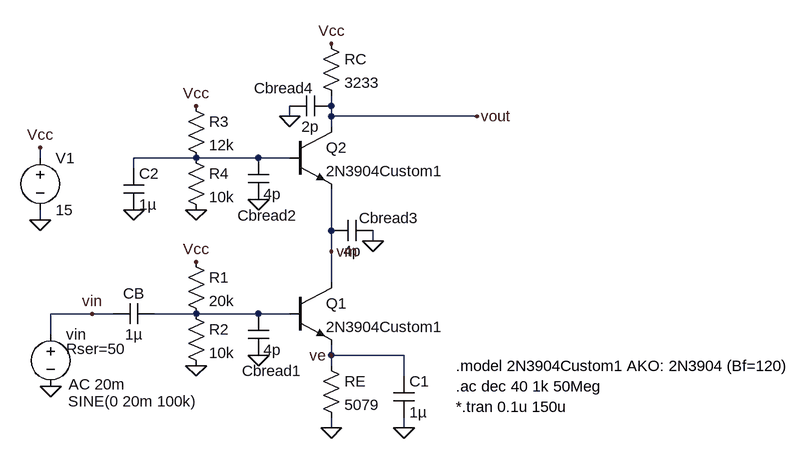
[diagram p0: schematic cascode.asc]
cascode.asc, the LTspice schematic file:
Version 4
SHEET 1 1252 680
WIRE 528 -96 528 -112
WIRE 464 -80 464 -96
WIRE 528 -80 528 -96
WIRE 752 -80 528 -80
WIRE 528 -64 528 -80
WIRE 80 -16 80 -32
WIRE 320 -16 224 -16
WIRE 416 -16 320 -16
WIRE 464 -16 416 -16
WIRE 224 0 224 -16
WIRE 80 80 80 64
WIRE 528 96 528 32
WIRE 592 112 592 96
WIRE 528 128 528 96
WIRE 528 176 528 128
WIRE 160 224 96 224
WIRE 192 224 160 224
WIRE 320 224 256 224
WIRE 416 224 320 224
WIRE 464 224 416 224
WIRE 96 256 96 224
WIRE 528 288 528 272
WIRE 640 288 528 288
WIRE 528 304 528 288
WIRE 640 320 640 288
WIRE 528 400 528 384
WIRE 640 400 640 384
FLAG 160 224 vin
FLAG 528 -192 Vcc
FLAG 752 -80 vout
FLAG 528 400 0
FLAG 80 80 0
FLAG 80 -32 Vcc
FLAG 528 288 ve
FLAG 96 336 0
FLAG 320 304 0
FLAG 320 144 Vcc
FLAG 320 64 0
FLAG 320 -96 Vcc
FLAG 224 64 0
FLAG 528 128 vm
FLAG 640 400 0
FLAG 416 288 0
FLAG 416 48 0
FLAG 592 112 0
FLAG 464 -80 0
SYMBOL Cap 256 208 R90
WINDOW 0 0 32 VBottom 2
WINDOW 3 32 32 VTop 2
SYMATTR InstName CB
SYMATTR Value 1µ
SYMBOL Res 512 -208 R0
SYMATTR InstName RC
SYMATTR Value 3233
SYMBOL Res 512 288 R0
SYMATTR InstName RE
SYMATTR Value 5079
SYMBOL Voltage 80 -32 R0
SYMATTR InstName V1
SYMATTR Value 15
SYMBOL npn 464 176 R0
SYMATTR InstName Q1
SYMATTR Value 2N3904Custom1
SYMBOL Cap 624 320 R0
SYMATTR InstName C1
SYMATTR Value 1µ
SYMBOL Voltage 96 240 R0
WINDOW 123 28 93 Left 2
WINDOW 3 27 119 Left 2
WINDOW 39 24 38 Left 2
SYMATTR Value2 AC 20m
SYMATTR Value SINE(0 20m 100k)
SYMATTR SpiceLine Rser=50
SYMATTR InstName vin
SYMBOL Res 304 128 R0
SYMATTR InstName R1
SYMATTR Value 20k
SYMBOL Res 304 208 R0
SYMATTR InstName R2
SYMATTR Value 10k
SYMBOL npn 464 -64 R0
SYMATTR InstName Q2
SYMATTR Value 2N3904Custom1
SYMBOL Res 304 -112 R0
SYMATTR InstName R3
SYMATTR Value 12k
SYMBOL Res 304 -32 R0
SYMATTR InstName R4
SYMATTR Value 10k
SYMBOL Cap 208 0 R0
SYMATTR InstName C2
SYMATTR Value 1µ
SYMBOL Cap 400 224 R0
WINDOW 0 -9 88 Left 2
SYMATTR InstName Cbread1
SYMATTR Value 4p
SYMBOL Cap 400 -16 R0
WINDOW 0 -16 89 Left 2
SYMATTR InstName Cbread2
SYMATTR Value 4p
SYMBOL Cap 592 80 R90
WINDOW 0 12 -25 VBottom 2
WINDOW 3 32 32 VTop 2
SYMATTR InstName Cbread3
SYMATTR Value 4p
SYMBOL Cap 528 -112 R90
WINDOW 0 4 72 VBottom 2
WINDOW 3 32 32 VTop 2
SYMATTR InstName Cbread4
SYMATTR Value 2p
TEXT 720 304 Left 2 !.model 2N3904Custom1 AKO: 2N3904 (Bf=120)
TEXT 720 336 Left 2 !.ac dec 40 1k 50Meg\n*.tran 0.1u 150u

The netlist it stands for:
* cascode.asc
CB N002 vin 1µ
RC Vcc vout 3233
RE ve 0 5079
V1 Vcc 0 15
Q1 vm N002 ve 0 2N3904Custom1
C1 ve 0 1µ
vin vin 0 SINE(0 20m 100k) AC 20m Rser=50
R1 Vcc N002 20k
R2 N002 0 10k
Q2 vout N001 vm 0 2N3904Custom1
R3 Vcc N001 12k
R4 N001 0 10k
C2 N001 0 1µ
Cbread1 N002 0 4p
Cbread2 N001 0 4p
Cbread3 0 vm 4p
Cbread4 vout 0 2p
.model NPN NPN
.model PNP PNP
.lib standard.bjt
.model 2N3904Custom1 AKO: 2N3904 (Bf=120)
.ac dec 40 1k 50Meg
*.tran 0.1u 150u
.backanno
.end